# EAGLE schematic placa_esp (EAGLE 9.6.2)
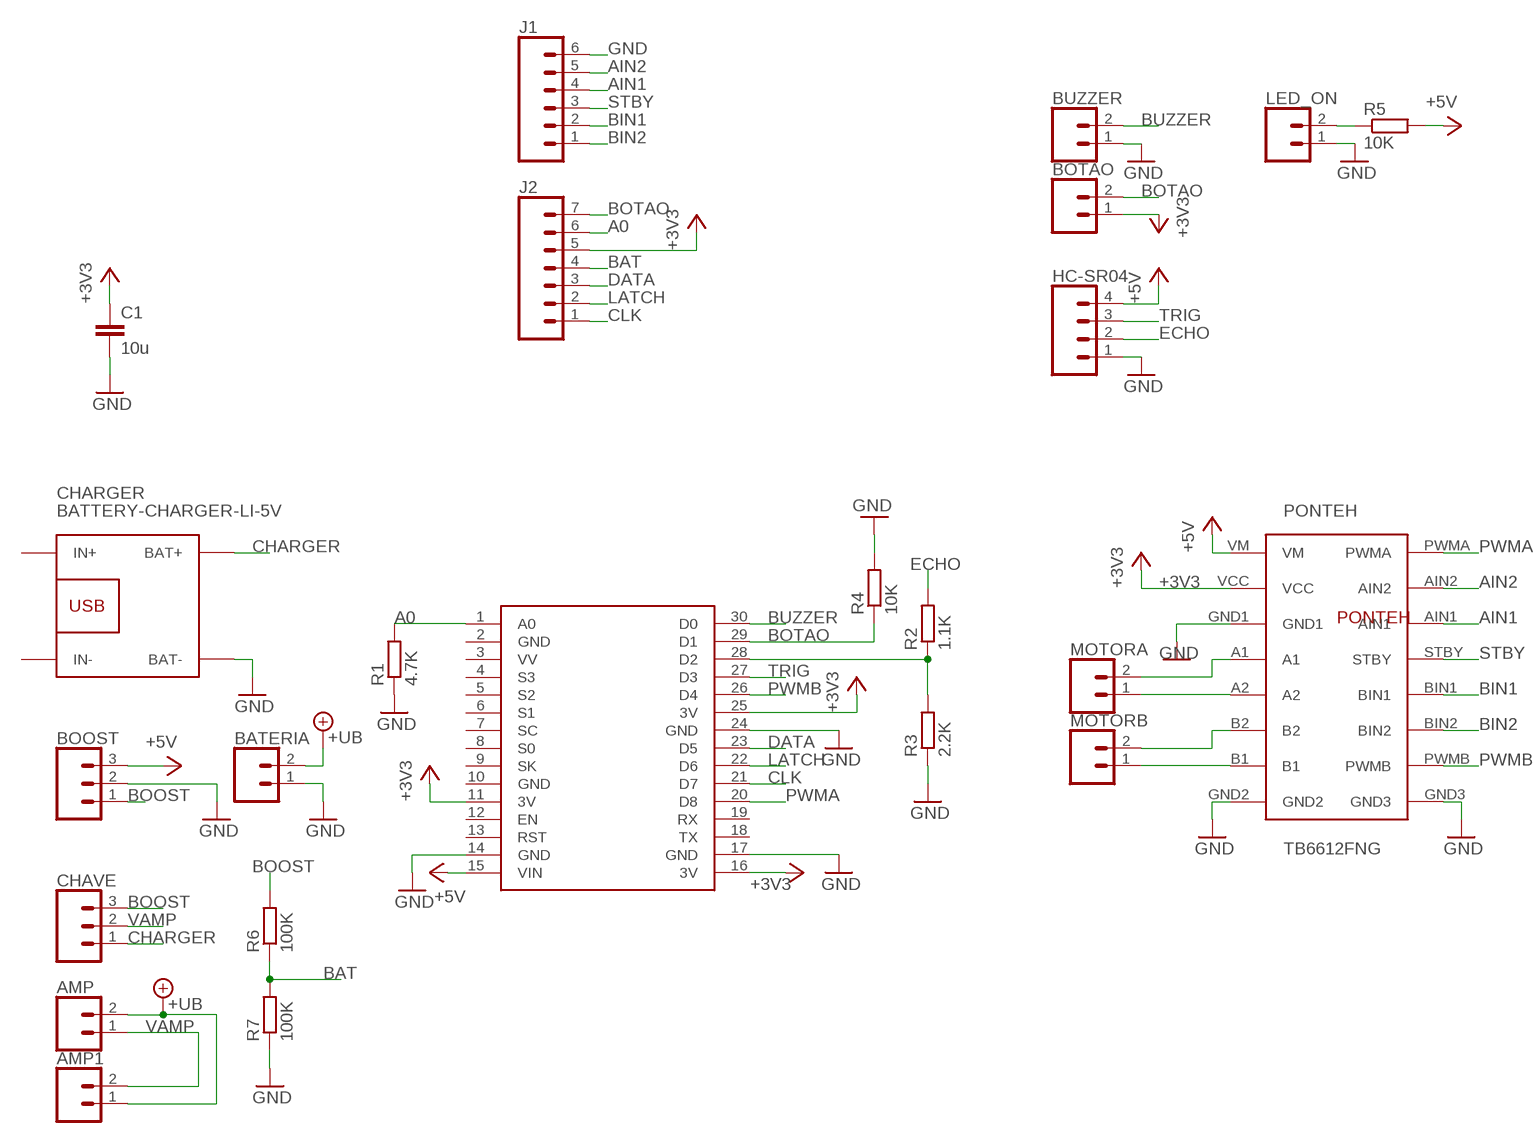
[diagram p0: schematic, sheet 1]

## Parts
AMP  CONN_02  [1X02]
AMP1  CONN_02  [1X02]
BATERIA  CONN_02  [1X02]
BOOST  CONN_03  [1X03]
BOTAO  CONN_02  [1X02]
BUZZER  CONN_02  [1X02]
C1  10u  C2,5-3  [C2.5-3]
CHARGER  BATTERY-CHARGER-LI-5V  [BATTERY-CHARGER-LI-5V]
CHAVE  CONN_03  [1X03]
HC-SR04  CONN_04  [1X04]
J1  CONN_06SILK_FEMALE_PTH  [1X06]
J2  CONN_07  [1X07]
LED_ON  CONN_02  [1X02]
MOTORA  CONN_02  [1X02]
MOTORB  CONN_02  [1X02]
NODEMCU  NODEMCU  [NODEMCU]
PONTEH  TB6612FNG  [TB6612FNG]
R1  4.7K  R-EU_0204/7  [0204/7]
R2  1.1K  R-EU_0204/7  [0204/7]
R3  2.2K  R-EU_0204/7  [0204/7]
R4  10K  R-EU_0204/7  [0204/7]
R5  10K  R-EU_0204/7  [0204/7]
R6  100K  R-EU_0204/7  [0204/7]
R7  100K  R-EU_0204/7  [0204/7]

## Nets
+3V3: BOTAO.1 C1.1 J2.5 NODEMCU.11(3V) NODEMCU.16(3V) NODEMCU.25(3V) PONTEH.VCC
+5V: BOOST.3 HC-SR04.4 NODEMCU.15(VIN) PONTEH.VM R5.2
+UB: AMP1.1 AMP.2 BATERIA.2
A0: J2.6 NODEMCU.1(A0) R1.2
AIN1: J1.4 PONTEH.AIN1
AIN2: J1.5 PONTEH.AIN2
BAT: J2.4 R6.1 R7.2
BIN1: J1.2 PONTEH.BIN1
BIN2: J1.1 PONTEH.BIN2
BOOST: BOOST.1 CHAVE.3 R6.2
BOTAO: BOTAO.2 J2.7 NODEMCU.29(D1) R4.1
BUZZER: BUZZER.2 NODEMCU.30(D0)
CHARGER: CHARGER.BAT+ CHAVE.1
CLK: J2.1 NODEMCU.21(D7)
DATA: J2.3 NODEMCU.23(D5)
ECHO: HC-SR04.2 R2.2
GND: BATERIA.1 BOOST.2 BUZZER.1 C1.2 CHARGER.BAT- HC-SR04.1 J1.6 LED_ON.1 NODEMCU.14(GND) NODEMCU.17(GND) NODEMCU.24(GND) PONTEH.GND1 PONTEH.GND2 PONTEH.GND3 R1.1 R3.1 R4.2 R7.1
LATCH: J2.2 NODEMCU.22(D6)
N$1: MOTORA.2 PONTEH.A1
N$2: MOTORA.1 PONTEH.A2
N$3: MOTORB.2 PONTEH.B2
N$4: MOTORB.1 PONTEH.B1
N$5: LED_ON.2 R5.1
N$39: NODEMCU.28(D2) R2.1 R3.2
PWMA: NODEMCU.20(D8) PONTEH.PWMA
PWMB: NODEMCU.26(D4) PONTEH.PWMB
STBY: J1.3 PONTEH.STBY
TRIG: HC-SR04.3 NODEMCU.27(D3)
VAMP: AMP1.2 AMP.1 CHAVE.2
Unconnected: CHARGER.IN+ CHARGER.IN- NODEMCU.3(VV) NODEMCU.4(S3) NODEMCU.5(S2) NODEMCU.6(S1) NODEMCU.7(SC) NODEMCU.8(S0) NODEMCU.9(SK) NODEMCU.12(EN) NODEMCU.13(RST) NODEMCU.18(TX) NODEMCU.19(RX)

## Power pins joined to a net without a drawn wire
GND: NODEMCU.2(GND) NODEMCU.10(GND)

## Library data of the parts
AMP AMP1 BATERIA BOTAO BUZZER LED_ON MOTORA MOTORB = SparkFun-Connectors:CONN_02: Multi connection point. Often used as Generic Header-pin footprint for 0.1 inch spaced/style header connections On any of the 0.1 inch spaced packages, you can populate with these: Break Away Headers - Straight <https://www.sparkfun.com/products/116> (PRT-00116) Break Away Male Headers - Right Angle <https://www.sparkfun.com/products/553> (PRT-00553) Female Headers <https://www.sparkfun.com/products/115> (PRT-00115) Break Away Headers - Machine Pin <https://www.sparkfun.com/products/117> (PRT-00117) Break Away Female Headers - Swiss Machine Pin <https://www.sparkfun.com/products/743> (PRT-00743) For SCREWTERMINALS and SPRING TERMINALS visit here: Screw Terimnals on SparkFun.com <https://www.sparkfun.com/search/results?term=Screw+Terminals> (5mm/3.5mm/2.54mm spacing) This device is also useful as a general connection point to wire up your design to another part of your project. Our various solder wires solder well into these plated through hole pads. Hook-Up Wire - Assortment (Stranded, 22 AWG) <https://www.sparkfun.com/products/11375> (PRT-11375) Hook-Up Wire - Assortment (Solid Core, 22 AWG) <https://www.sparkfun.com/products/11367> (PRT-11367) View the entire wire category on our website here <https://www.sparkfun.com/categories/141> Special notes: Molex polarized connector foot print use with: PRT-08233 with associated crimp pins and housings. 2.54_SCREWTERM for use with PRT-10571. 3.5mm Screw Terminal footprints for PRT-08084 5mm Screw Terminal footprints for use with PRT-08432
BOOST CHAVE = SparkFun-Connectors:CONN_03: Multi connection point. Often used as Generic Header-pin footprint for 0.1 inch spaced/style header connections On any of the 0.1 inch spaced packages, you can populate with these: Break Away Headers - Straight <https://www.sparkfun.com/products/116> (PRT-00116) Break Away Male Headers - Right Angle <https://www.sparkfun.com/products/553> (PRT-00553) Female Headers <https://www.sparkfun.com/products/115> (PRT-00115) Break Away Headers - Machine Pin <https://www.sparkfun.com/products/117> (PRT-00117) Break Away Female Headers - Swiss Machine Pin <https://www.sparkfun.com/products/743> (PRT-00743) Stackable Header - 3 Pin (Female, 0.1") <https://www.sparkfun.com/products/13875> (PRT-13875) For SCREWTERMINALS and SPRING TERMINALS visit here: Screw Terimnals on SparkFun.com <https://www.sparkfun.com/search/results?term=Screw+Terminals> (5mm/3.5mm/2.54mm spacing) This device is also useful as a general connection point to wire up your design to another part of your project. Our various solder wires solder well into these plated through hole pads. Hook-Up Wire - Assortment (Stranded, 22 AWG) <https://www.sparkfun.com/products/11375> (PRT-11375) Hook-Up Wire - Assortment (Solid Core, 22 AWG) <https://www.sparkfun.com/products/11367> (PRT-11367) View the entire wire category on our website here <https://www.sparkfun.com/categories/141> Special notes: Molex polarized connector foot print use with SKU : PRT-08232 with associated crimp pins and housings.
C1 = capacitor-wima:C: CAPACITOR naming: grid - package width
CHARGER = diy-modules:BATTERY-CHARGER-LI-5V: Lithium Battery 5V Charger More details available here: http://www.buildcircuit.com/how-to-use-micro-usb-5v-1a-lithium-battery-charging-board-charger-module/ Click here to find device on ebay.com <http://www.ebay.com/sch/tp4056+charger+usb>
HC-SR04 = SparkFun-Connectors:CONN_04: Multi connection point. Often used as Generic Header-pin footprint for 0.1 inch spaced/style header connections On any of the 0.1 inch spaced packages, you can populate with these: Break Away Headers - Straight <https://www.sparkfun.com/products/116> (PRT-00116) Break Away Male Headers - Right Angle <https://www.sparkfun.com/products/553> (PRT-00553) Female Headers <https://www.sparkfun.com/products/115> (PRT-00115) Break Away Headers - Machine Pin <https://www.sparkfun.com/products/117> (PRT-00117) Break Away Female Headers - Swiss Machine Pin <https://www.sparkfun.com/products/743> (PRT-00743) For SCREWTERMINALS and SPRING TERMINALS visit here: Screw Terimnals on SparkFun.com <https://www.sparkfun.com/search/results?term=Screw+Terminals> (5mm/3.5mm/2.54mm spacing) This device is also useful as a general connection point to wire up your design to another part of your project. Our various solder wires solder well into these plated through hole pads. Hook-Up Wire - Assortment (Stranded, 22 AWG) <https://www.sparkfun.com/products/11375> (PRT-11375) Hook-Up Wire - Assortment (Solid Core, 22 AWG) <https://www.sparkfun.com/products/11367> (PRT-11367) View the entire wire category on our website here <https://www.sparkfun.com/categories/141> Special notes: Molex polarized connector foot print use with SKU : PRT-08231 with associated crimp pins and housings. 1MM SMD Version SKU: PRT-10208; PROD_ID: CONN-09696
J1 = SparkFun-Connectors:CONN_06: Multi connection point. Often used as Generic Header-pin footprint for 0.1 inch spaced/style header connections On any of the 0.1 inch spaced packages, you can populate with these: Break Away Headers - Straight <https://www.sparkfun.com/products/116> (PRT-00116) Break Away Male Headers - Right Angle <https://www.sparkfun.com/products/553> (PRT-00553) Female Headers <https://www.sparkfun.com/products/115> (PRT-00115) Break Away Headers - Machine Pin <https://www.sparkfun.com/products/117> (PRT-00117) Break Away Female Headers - Swiss Machine Pin <https://www.sparkfun.com/products/743> (PRT-00743) Arduino Stackable Header - 6 Pin <https://www.sparkfun.com/products/9280> (PRT-09280) For SCREWTERMINALS and SPRING TERMINALS visit here: Screw Terimnals on SparkFun.com <https://www.sparkfun.com/search/results?term=Screw+Terminals> (5mm/3.5mm/2.54mm spacing) This device is also useful as a general connection point to wire up your design to another part of your project. Our various solder wires solder well into these plated through hole pads. Hook-Up Wire - Assortment (Stranded, 22 AWG) <https://www.sparkfun.com/products/11375> (PRT-11375) Hook-Up Wire - Assortment (Solid Core, 22 AWG) <https://www.sparkfun.com/products/11367> (PRT-11367) View the entire wire category on our website here <https://www.sparkfun.com/categories/141>; PROD_ID: CONN-08437
J2 = SparkFun-Connectors:CONN_07: Multi connection point. Often used as Generic Header-pin footprint for 0.1 inch spaced/style header connections On any of the 0.1 inch spaced packages, you can populate with these: Break Away Headers - Straight <https://www.sparkfun.com/products/116> (PRT-00116) Break Away Male Headers - Right Angle <https://www.sparkfun.com/products/553> (PRT-00553) Female Headers <https://www.sparkfun.com/products/115> (PRT-00115) Break Away Headers - Machine Pin <https://www.sparkfun.com/products/117> (PRT-00117) Break Away Female Headers - Swiss Machine Pin <https://www.sparkfun.com/products/743> (PRT-00743) For SCREWTERMINALS and SPRING TERMINALS visit here: Screw Terimnals on SparkFun.com <https://www.sparkfun.com/search/results?term=Screw+Terminals> (5mm/3.5mm/2.54mm spacing) This device is also useful as a general connection point to wire up your design to another part of your project. Our various solder wires solder well into these plated through hole pads. Hook-Up Wire - Assortment (Stranded, 22 AWG) <https://www.sparkfun.com/products/11375> (PRT-11375) Hook-Up Wire - Assortment (Solid Core, 22 AWG) <https://www.sparkfun.com/products/11367> (PRT-11367) View the entire wire category on our website here <https://www.sparkfun.com/categories/141> Special notes: Molex polarized connector foot print use with SKU : PRT-08231 with associated crimp pins and housings. 1MM SMD Version SKU: PRT-10208 NOTES ON THE VARIANTS LOCK and LOCK_LONGPADS... This footprint was designed to help hold the alignment of a through-hole component (i.e. 6-pin header) while soldering it into place. You may notice that each hole has been shifted either up or down by 0.005 of an inch from it's more standard position (which is a perfectly straight line). This slight alteration caused the pins (the squares in the middle) to touch the edges of the holes. Because they are alternating, it causes a "brace" to hold the component in place. 0.005 has proven to be the perfect amount of "off-center" position when using our standard breakaway headers. Although looks a little odd when you look at the bare footprint, once you have a header in there, the alteration is very hard to notice. Also,if you push a header all the way into place, it is covered up entirely on the bottom side.
NODEMCU = nodemcu:NODEMCU
PONTEH = TB6612FNG:TB6612FNG
R1-R7 = rcl:R-EU_: RESISTOR, European symbol; SPICEPREFIX: R